# EasyEDA schematic SCH_RETOFISH-V1_2025-09-10.json
TITLE: RETOFISH; REV: 1.0; Date: 2025-09-08; Sheet: 1/1; Drawn By: Khải Phan Anh; Company: RETOBOTS
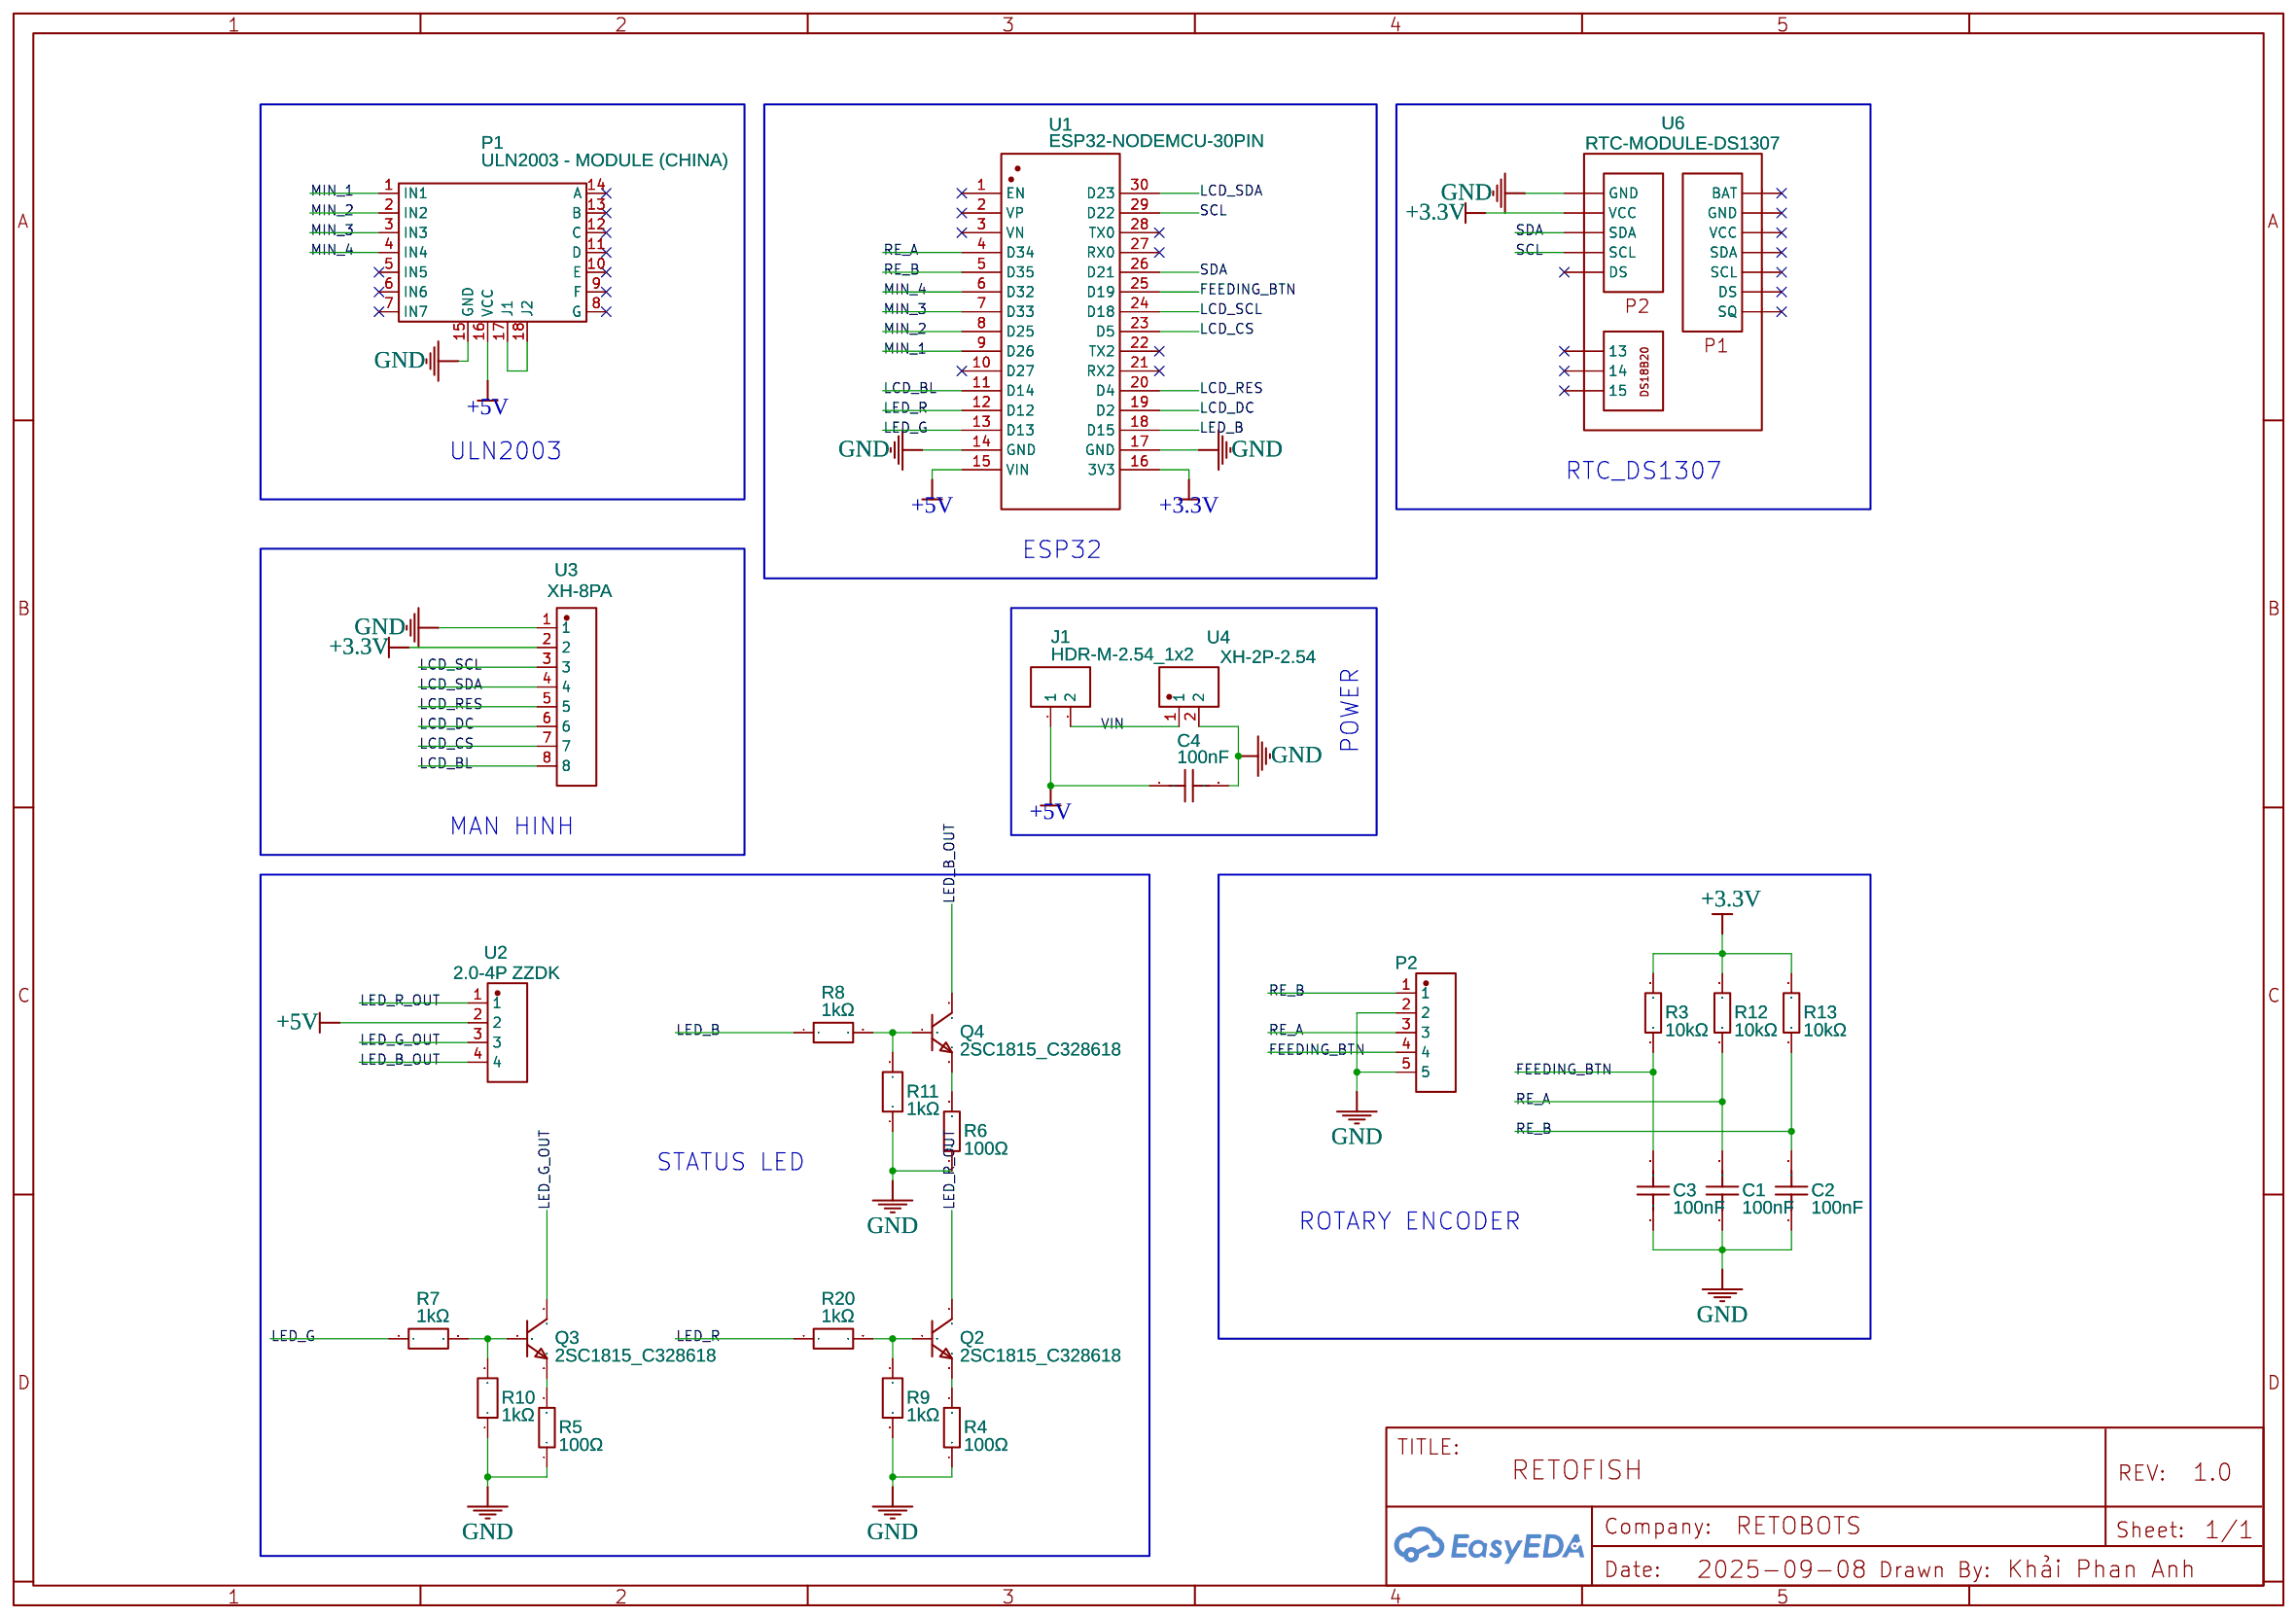
[diagram p0: schematic sheet]

## Parts
C1  100nF  [CAP-TH_L5.8-W2.4-P2.54-D0.6]
C2  100nF  [CAP-TH_L5.8-W2.4-P2.54-D0.6]
C3  100nF  [CAP-TH_L5.8-W2.4-P2.54-D0.6]
C4  100nF  [CAP-TH_L5.8-W2.4-P2.54-D0.6]
J1  HDR-M-2.54_1x2  [HDR-M-2.54_1X2]
P1  ULN2003 - MODULE (CHINA)  [ULN2003-MODULE]
P2  XH-2.54-5P  [CONN-TH_XH2.54-5P]
Q2  2SC1815_C328618  [TO-92-3_L4.6-W3.6-P1.27-L_1]
Q3  2SC1815_C328618  [TO-92-3_L4.6-W3.6-P1.27-L_1]
Q4  2SC1815_C328618  [TO-92-3_L4.6-W3.6-P1.27-L_1]
R3  10kΩ  [RES-TH_BD2.3-L6.5-P10.50-D0.5]
R4  100Ω  [RES-TH_BD2.3-L6.5-P10.50-D0.5]
R5  100Ω  [RES-TH_BD2.3-L6.5-P10.50-D0.5]
R6  100Ω  [RES-TH_BD2.3-L6.5-P10.50-D0.5]
R7  1kΩ  [RES-TH_BD2.3-L6.5-P10.50-D0.5]
R8  1kΩ  [RES-TH_BD2.3-L6.5-P10.50-D0.5]
R9  1kΩ  [RES-TH_BD2.3-L6.5-P10.50-D0.5]
R10  1kΩ  [RES-TH_BD2.3-L6.5-P10.50-D0.5]
R11  1kΩ  [RES-TH_BD2.3-L6.5-P10.50-D0.5]
R12  10kΩ  [RES-TH_BD2.3-L6.5-P10.50-D0.5]
R13  10kΩ  [RES-TH_BD2.3-L6.5-P10.50-D0.5]
R20  1kΩ  [RES-TH_BD2.3-L6.5-P10.50-D0.5]
U1  ESP32-NODEMCU-30PIN  [ESP32-NODEMCU-30PIN]
U2  2.0-4P ZZDK  [HDR-TH_4P-P2.00_SHOUHAN_2.0-4P-ZZDK]
U3  XH-8PA  [CONN-TH_KH-XH-8A-Z]
U4  XH-2P-2.54  [CONN-TH_2P-P2.50-XH2.54-2P]
U6  RTC-MODULE-DS1307  [FP_RTC-MODULE-DS1307]

## Library data of the parts
C1-C3 = CC1H104ZA1ED3F5P1100: Contributor: LCSC; Supplier: LCSC; Supplier Part: C2832506; Manufacturer: Dersonic(德尔创); JLCPCB Part Class: Extended Part; link: https://lcsc.com/eda_search?q=C2832506&%26type=1&ref=editor
C4 = CC1H104ZA1ED3F5P1100: Contributor: LCSC; Supplier: LCSC; Supplier Part: C2832506; Manufacturer: Dersonic(德尔创); JLCPCB Part Class: Extended Part
J1 = HDR-M-2.54_1x2: Supplier Part: C124375; Supplier: LCSC; Contributor: LCEDA_Lib
P1 = ULN2003 - MODULE (CHINA): Supplier: LCSC; Manufacturer: BOOMELE; Manufacturer Part: Female headerHDR1X8-2.54; Supplier Part: C27438; LCSC Assembly: Yes; SMT Type: Extend; Paste Type: expand
P2 = XH-2.54-5P: Contributor: LCSC; Supplier: LCSC; Supplier Part: C9900003918; Manufacturer: null; JLCPCB Part Class: Extended Part
Q2-Q4 = 2SC1815_C328618: Contributor: LCSC; Supplier: LCSC; Supplier Part: C328618; Manufacturer: BLUE ROCKET(蓝箭); Manufacturer Part: 2SC1815-GR; JLCPCB Part Class: Extended Part
R3 R12 R13 = MF1/4W-10KΩ±1% T52: Contributor: LCSC; Supplier: LCSC; Supplier Part: C119347; Manufacturer: CCO(千志电子); Manufacturer Part: MF1/4W-10KΩ±1% T; JLCPCB Part Class: Extended Part
R4-R6 = CF1/4W-100Ω±5% T52: Contributor: LCSC; Supplier: LCSC; Supplier Part: C120031; Manufacturer: CCO(千志电子); Manufacturer Part: CF1/4W-100Ω±5% T; JLCPCB Part Class: Extended Part
R7-R11 R20 = MF1/4W-1KΩ±1%T52: Contributor: LCSC; Supplier: LCSC; Supplier Part: C713997; Manufacturer: 华星机电; JLCPCB Part Class: Extended Part
U1 = ESP32-NODEMCU-30PIN: Manufacturer: Espreciff; Contributor: LincolnFA
U2 = 2.0-4P ZZDK: Supplier: LCSC; Supplier Part: C18185605; Manufacturer: SHOU HAN(首韩); Contributor: lcsc
U3 = XH-8PA: Contributor: lcsc; Supplier: LCSC; Supplier Part: C5258889; Manufacturer: ZHOURI(洲日); JLCPCB Part Class: Extended Part
U4 = XH-2P-2.54: Contributor: LCSC; Convert to PCB: Yes; Add into BOM: Yes; Supplier: LCSC; Supplier Part: C9900003929; Manufacturer: null; JLCPCB Part Class: Extended Part
U6 = SB_RTC-MODULE-DS1307 COPY: Contributor: viniciusantunes

## Nets
+3.3V: R3.2 R12.2 R13.2 U1.16(3V3) U3.2 U6.2(VCC)
+5V: C4.1 J1.1 P1.16(VCC) U1.15(VIN) U2.2
GND: C1.1 C2.1 C3.1 C4.2 P1.15(GND) P2.2 P2.5 R4.1 R5.1 R6.1 R9.1 R10.1 R11.1 U1.14(GND) U1.17(GND) U3.1 U4.2 U6.1(GND)
VIN: J1.2 U4.1
FEEDING_BTN: C3.2 P2.4 R3.1 U1.25(D19)
LCD_BL: U1.11(D14) U3.8
LCD_CS: U1.23(D5) U3.7
LCD_DC: U1.19(D2) U3.6
LCD_RES: U1.20(D4) U3.5
LCD_SCL: U1.24(D18) U3.3
LCD_SDA: U1.30(D23) U3.4
LED_B: R8.1 U1.18(D15)
LED_B_OUT: Q4.2(C) U2.4
LED_G: R7.1 U1.13(D13)
LED_G_OUT: Q3.2(C) U2.3
LED_R: R20.1 U1.12(D12)
LED_R_OUT: Q2.2(C) U2.1
MIN_1: P1.1(IN1) U1.9(D26)
MIN_2: P1.2(IN2) U1.8(D25)
MIN_3: P1.3(IN3) U1.7(D33)
MIN_4: P1.4(IN4) U1.6(D32)
RE_A: C1.2 P2.3 R12.1 U1.4(D34)
RE_B: C2.2 P2.1 R13.1 U1.5(D35)
SCL: U1.29(D22) U6.4(SCL)
SDA: U1.26(D21) U6.3(SDA)
Net-(P1-17): P1.17(J1) P1.18(J2)
Net-(Q2-1): Q2.1(B) R9.2 R20.2
Net-(Q2-3): Q2.3(E) R4.2
Net-(Q3-1): Q3.1(B) R7.2 R10.2
Net-(Q3-3): Q3.3(E) R5.2
Net-(Q4-1): Q4.1(B) R8.2 R11.2
Net-(Q4-3): Q4.3(E) R6.2

Not connected (* = marked no-connect by the designer): P1 5(IN5)* 6(IN6)* 7(IN7)* 8(G)* 9(F)* 10(E)* 11(D)* 12(C)* 13(B)* 14(A)*; U1 1(EN)* 2(VP)* 3(VN)* 10(D27)* 21(RX2)* 22(TX2)* 27(RX0)* 28(TX0)*; U6 5(DS)* 6(BAT)* 7(GND)* 8(VCC)* 9(SDA)* 10(SCL)* 11(DS)* 12(SQ)* 13* 14* 15*

## Notes on the sheet
- ULN2003
- RTC_DS1307
- ESP32
- POWER
- MAN HINH
- STATUS LED
- ROTARY ENCODER
